# EAGLE design tulip breakout (EAGLE 9.6.2)
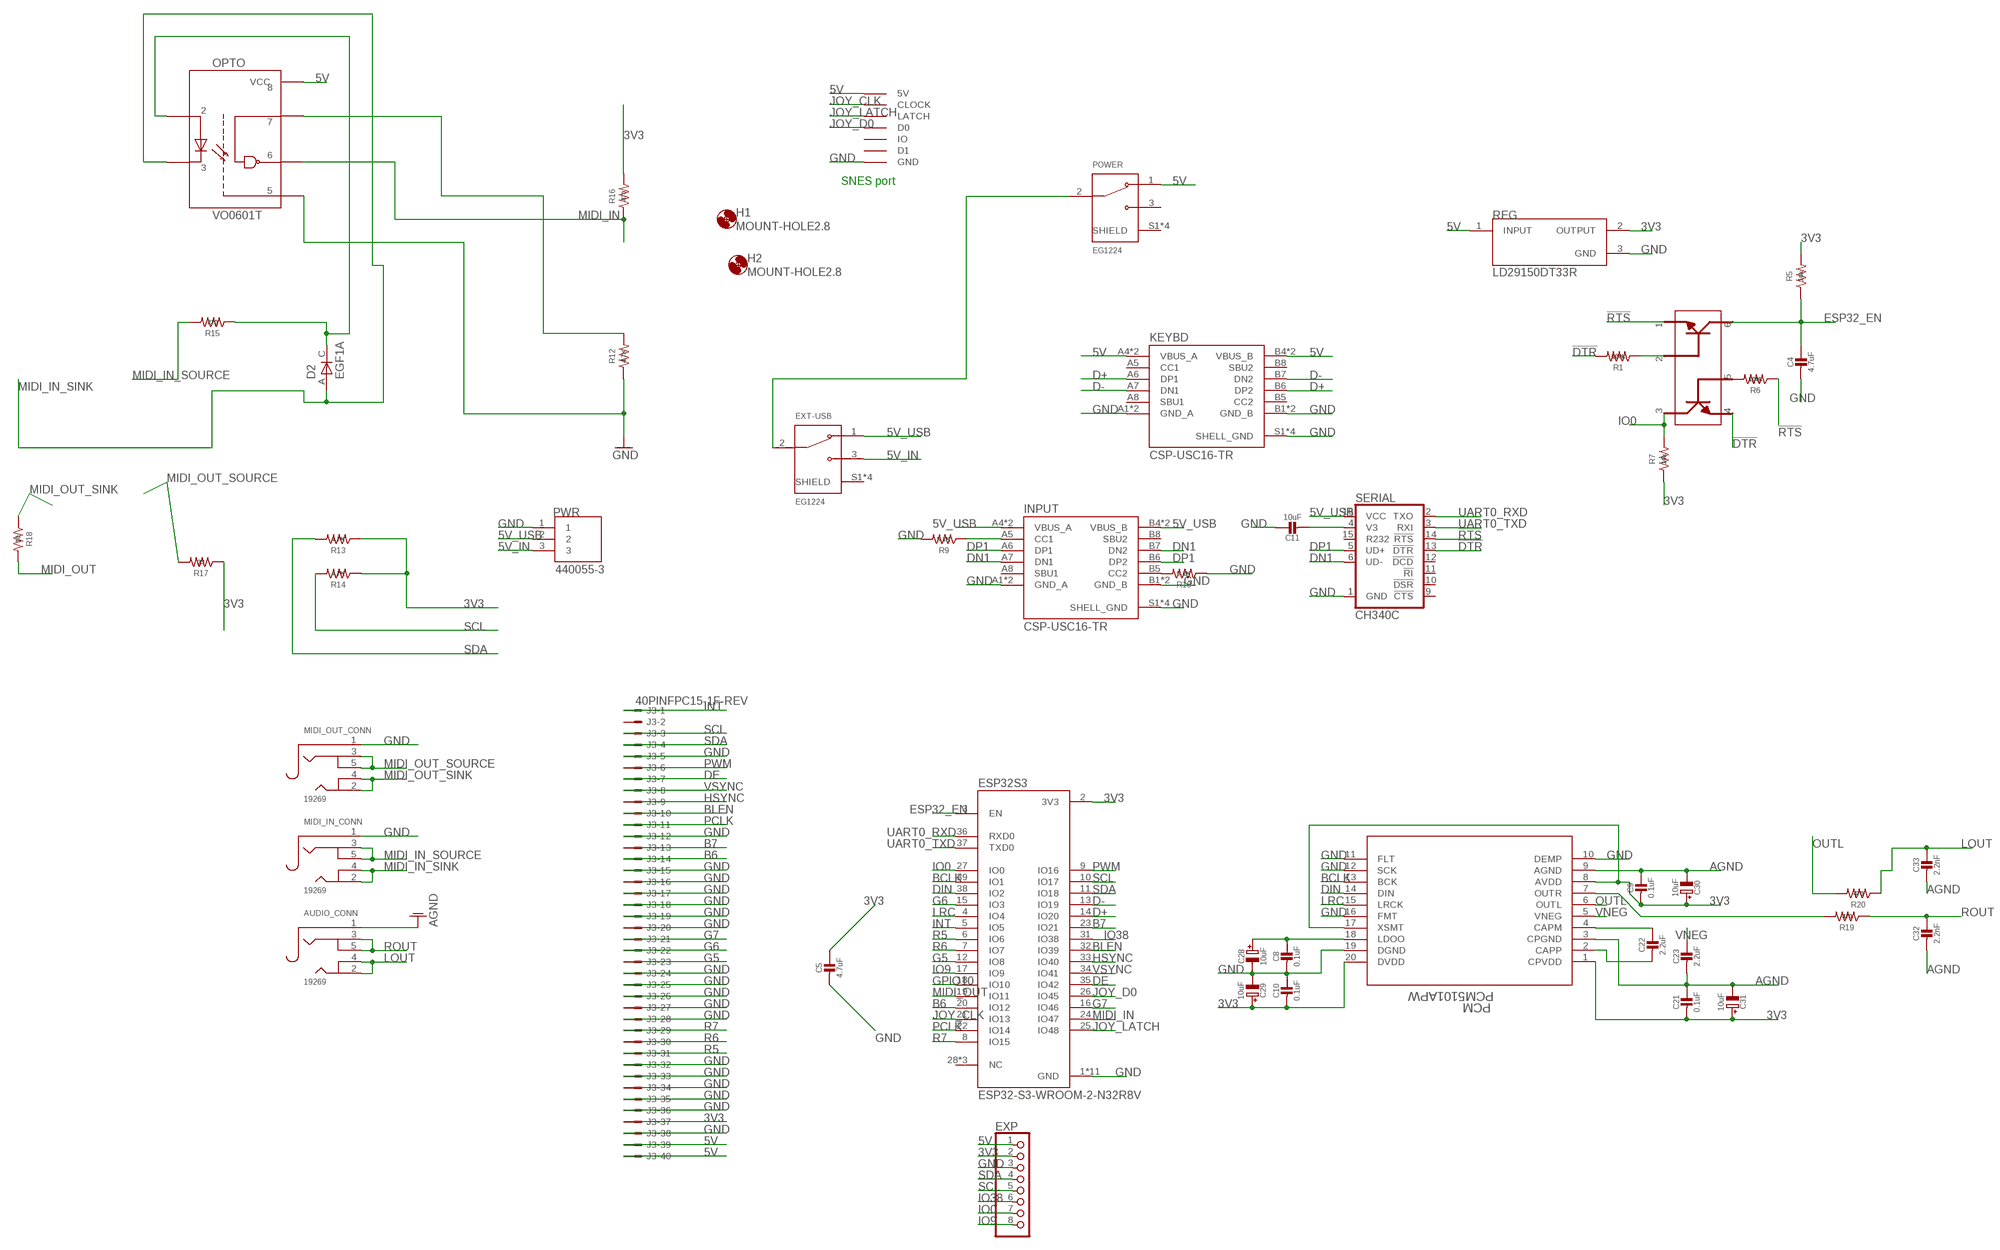
[diagram p0: schematic, sheet 1]

## Parts
AUDIO_CONN  19269  AUDIO_3.5MMJACK  [4UCONN_19269]
C4  4.7uF  CAP_CERAMIC0805-NOOUTLINE  [0805-NO]
C5  4.7uF  CAP_CERAMIC0805-NOOUTLINE  [0805-NO]
C8  0.1uF  CAP_CERAMIC0805-NOOUTLINE  [0805-NO]
C9  0.1uF  CAP_CERAMIC0805-NOOUTLINE  [0805-NO]
C10  0.1uF  CAP_CERAMIC0805-NOOUTLINE  [0805-NO]
C11  10uF  CAP_CERAMIC0805-NOOUTLINE  [0805-NO]
C21  0.1uF  CAP_CERAMIC0805-NOOUTLINE  [0805-NO]
C22  2.2uF  CAP_CERAMIC0805-NOOUTLINE  [0805-NO]
C23  2.2uF  CAP_CERAMIC0805-NOOUTLINE  [0805-NO]
C28  10uF  CAP_ELECTROLYTICPANASONIC_C  [PANASONIC_C]
C29  10uF  CAP_ELECTROLYTICPANASONIC_C  [PANASONIC_C]
C30  10uF  CAP_ELECTROLYTICPANASONIC_C  [PANASONIC_C]
C31  10uF  CAP_ELECTROLYTICPANASONIC_C  [PANASONIC_C]
C32  2.2nF  CAP_CERAMIC0805-NOOUTLINE  [0805-NO]
C33  2.2nF  CAP_CERAMIC0805-NOOUTLINE  [0805-NO]
D2  EGF1A  [DIOM449X264X300L114X135N]
ESP32S3  ESP32-S3-WROOM-2-N32R8V  [XCVR_ESP32-S3-WROOM-2-N32R8V]
EXP  PINHD-1X8BIG  [1X08-BIG]
EXT-USB  EG1224  [SW_EG1224]
H1  MOUNT-HOLE2.8  [2,8]
H2  MOUNT-HOLE2.8  [2,8]
INPUT  CSP-USC16-TR  [VALCON_CSP-USC16-TR]
J3  40PINFPC15-1F-REV  [XF2M-4015-1F-REVERSE]
KEYBD  CSP-USC16-TR  [VALCON_CSP-USC16-TR]
MIDI_IN_CONN  19269  AUDIO_3.5MMJACK  [4UCONN_19269]
MIDI_OUT_CONN  19269  AUDIO_3.5MMJACK  [4UCONN_19269]
OPTO  VO0601T  [SOIC127P610X331-8N]
PCM  PCM5101APW  [PW20_TEX]
POWER  EG1224  [SW_EG1224]
PWR  440055-3  [TE_440055-3]
R1  100k  R-US_R0805  [R0805]
R5  10k  R-US_R0805  [R0805]
R6  100k  R-US_R0805  [R0805]
R7  10k  R-US_R0805  [R0805]
R9  5.1K  R-US_R0805  [R0805]
R10  5.1K  R-US_R0805  [R0805]
R12  4.7K  R-US_R0805  [R0805]
R13  4.7K  R-US_R0805  [R0805]
R14  4.7K  R-US_R0805  [R0805]
R15  220  R-US_R0805  [R0805]
R16  470  R-US_R0805  [R0805]
R17  33  R-US_R0805  [R0805]
R18  10  R-US_R0805  [R0805]
R19  470  R-US_R0805  [R0805]
R20  470  R-US_R0805  [R0805]
REG  LD29150DT33R  [DPAK456P972X240-3N]
RESET  MBT3904DW1T1G  [SOT236]
SERIAL  CH340C  [SO016]
SNES  SNESCONN  [SNESCONN]

## Nets
3V3: C5.1 C9.2 C10.2 C21.2 C29.+ C30.+ C31.+ ESP32S3.2(3V3) EXP.2 J3.37 PCM.1(CPVDD) PCM.8(AVDD) PCM.17(XSMT) PCM.20(DVDD) R5.2 R7.1 R13.1 R14.1 R16.2 R17.1 REG.2(OUTPUT)
5V: EXP.1 J3.39 J3.40 KEYBD.A4(VBUS_A) KEYBD.A9(VBUS_A) KEYBD.B4(VBUS_B) KEYBD.B9(VBUS_B) OPTO.8(VCC) POWER.1 REG.1(INPUT) SNES.5V
5V_IN: EXT-USB.3 PWR.3
5V_USB: EXT-USB.1 INPUT.A4(VBUS_A) INPUT.A9(VBUS_A) INPUT.B4(VBUS_B) INPUT.B9(VBUS_B) PWR.2 SERIAL.16(VCC)
!DTR: R1.2 RESET.4 SERIAL.13(!DTR)
!RTS: R6.1 RESET.1 SERIAL.14(!RTS)
AGND: AUDIO_CONN.1 C9.1 C21.1 C23.2 C30.- C31.- C32.2 C33.2 PCM.3(CPGND) PCM.9(AGND)
B6: ESP32S3.20(IO12) J3.14
B7: ESP32S3.23(IO21) J3.13
BCLK: ESP32S3.39(IO1) PCM.13(BCK)
BLEN: ESP32S3.32(IO39) J3.10
D+: ESP32S3.14(IO20) KEYBD.A6(DP1) KEYBD.B6(DP2)
D-: ESP32S3.13(IO19) KEYBD.A7(DN1) KEYBD.B7(DN2)
DE: ESP32S3.35(IO42) J3.7
DIN: ESP32S3.38(IO2) PCM.14(DIN)
DN1: INPUT.A7(DN1) INPUT.B7(DN2) SERIAL.6(UD-)
DP1: INPUT.A6(DP1) INPUT.B6(DP2) SERIAL.5(UD+)
ESP32_EN: C4.1 ESP32S3.3(EN) R5.1 RESET.6
EXT-USB: EXT-USB.2 POWER.2
G5: ESP32S3.12(IO8) J3.23
G6: ESP32S3.15(IO3) J3.22
G7: ESP32S3.16(IO46) J3.21
GND: C4.2 C5.2 C8.2 C10.1 C11.1 C28.- C29.- ESP32S3.1(GND) ESP32S3.40(GND) ESP32S3.41_1(GND) ESP32S3.41_2(GND) ESP32S3.41_3(GND) ESP32S3.41_4(GND) ESP32S3.41_5(GND) ESP32S3.41_6(GND) ESP32S3.41_7(GND) ESP32S3.41_8(GND) ESP32S3.41_9(GND) EXP.3 INPUT.A1(GND_A) INPUT.A12(GND_A) INPUT.B1(GND_B) INPUT.B12(GND_B) INPUT.S1(SHELL_GND) INPUT.S2(SHELL_GND) INPUT.S3(SHELL_GND) INPUT.S4(SHELL_GND) J3.5 J3.12 J3.15 J3.16 J3.17 J3.18 J3.19 J3.20 J3.24 J3.25 J3.26 J3.27 J3.28 J3.32 J3.33 J3.34 J3.35 J3.36 J3.38 KEYBD.A1(GND_A) KEYBD.A12(GND_A) KEYBD.B1(GND_B) KEYBD.B12(GND_B) KEYBD.S1(SHELL_GND) KEYBD.S2(SHELL_GND) KEYBD.S3(SHELL_GND) KEYBD.S4(SHELL_GND) MIDI_IN_CONN.1 MIDI_OUT_CONN.1 OPTO.5(GND) PCM.10(DEMP) PCM.11(FLT) PCM.12(SCK) PCM.16(FMT) PCM.19(DGND) PWR.1 R9.2 R10.1 R12.1 REG.3(GND) SERIAL.1(GND) SNES.GND
GPIO10: ESP32S3.18(IO10)
HSYNC: ESP32S3.33(IO40) J3.9
INT: ESP32S3.5(IO5) J3.1
IO0: ESP32S3.27(IO0) EXP.7 R7.2 RESET.3
IO9: ESP32S3.17(IO9) EXP.8
IO38: ESP32S3.31(IO38) EXP.6
JOY_CLK: ESP32S3.21(IO13) SNES.CLOCK
JOY_D0: ESP32S3.26(IO45) SNES.D0
JOY_LATCH: ESP32S3.25(IO48) SNES.LATCH
LOUT: AUDIO_CONN.2 AUDIO_CONN.4 C33.1 R20.1
LRC: ESP32S3.4(IO4) PCM.15(LRCK)
MIDI_IN: ESP32S3.24(IO47) OPTO.6(VO) R16.1
MIDI_IN_SINK: D2.A MIDI_IN_CONN.2 MIDI_IN_CONN.4 OPTO.3(C)
MIDI_IN_SOURCE: MIDI_IN_CONN.3 MIDI_IN_CONN.5 R15.2
MIDI_OUT: ESP32S3.19(IO11) R18.2
MIDI_OUT_SINK: MIDI_OUT_CONN.2 MIDI_OUT_CONN.4 R18.1
MIDI_OUT_SOURCE: MIDI_OUT_CONN.3 MIDI_OUT_CONN.5 R17.2
N$1: R1.1 RESET.2
N$2: R6.2 RESET.5
N$3: INPUT.B5(CC2) R10.2
N$7: C8.1 C28.+ PCM.18(LDOO)
N$8: PCM.7(OUTR) R19.2
N$16: C22.1 PCM.4(CAPM)
N$18: C22.2 PCM.2(CAPP)
N$30: D2.C OPTO.2(A) R15.1
N$32: OPTO.7(VE) R12.2
N$38: C11.2 SERIAL.4(V3)
N$42: INPUT.A5(CC1) R9.1
OUTL: PCM.6(OUTL) R20.2
PCLK: ESP32S3.22(IO14) J3.11
PWM: ESP32S3.9(IO16) J3.6
R5: ESP32S3.6(IO6) J3.31
R6: ESP32S3.7(IO7) J3.30
R7: ESP32S3.8(IO15) J3.29
ROUT: AUDIO_CONN.3 AUDIO_CONN.5 C32.1 R19.1
SCL: ESP32S3.10(IO17) EXP.5 J3.3 R14.2
SDA: ESP32S3.11(IO18) EXP.4 J3.4 R13.2
UART0_RXD: ESP32S3.36(RXD0) SERIAL.2(TXO)
UART0_TXD: ESP32S3.37(TXD0) SERIAL.3(RXI)
VNEG: C23.1 PCM.5(VNEG)
VSYNC: ESP32S3.34(IO41) J3.8
Unconnected: ESP32S3.28(NC) ESP32S3.29(NC) ESP32S3.30(NC) EXT-USB.S1(SHIELD) EXT-USB.S2(SHIELD) EXT-USB.S3(SHIELD) EXT-USB.S4(SHIELD) INPUT.A8(SBU1) INPUT.B8(SBU2) J3.2 KEYBD.A5(CC1) KEYBD.A8(SBU1) KEYBD.B5(CC2) KEYBD.B8(SBU2) POWER.3 POWER.S1(SHIELD) POWER.S2(SHIELD) POWER.S3(SHIELD) POWER.S4(SHIELD) SERIAL.9(!CTS) SERIAL.10(!DSR) SERIAL.11(!RI) SERIAL.12(!DCD) SERIAL.15(R232) SNES.D1 SNES.IO

## Notes on the sheet
- SNES port

## Library data of the parts
AUDIO_CONN MIDI_IN_CONN MIDI_OUT_CONN = microbuilder:AUDIO_3.5MMJACK: 3.5MM Audio Jack These are normally connected as follows, from left-to right on the schematic symbol above: Tip: Left Audio Inner Ring: Right Audio Shell: Common/GND
C4 C5 C8-C11 C21-C23 C32 C33 = microbuilder:CAP_CERAMIC: Ceramic Capacitors For new designs, use the packages preceded by an '_' character since they are more reliable: The following footprints should be used on most boards: _0402 - Standard footprint for regular board layouts _0603 - Standard footprint for regular board layouts _0805 - Standard footprint for regular board layouts _1206 - Standard footprint for regular board layouts For extremely tight-pitch boards where space is at a premium, the following 'micro-pitch' footprints can be used (smaller pads, no silkscreen outline, etc.): _0402MP - Micro-pitch footprint for very dense/compact boards _0603MP - Micro-pitch footprint for very dense/compact boards _0805MP - Micro-pitch footprint for very dense/compact boards _1206MP - Micro-pitch footprint for very dense/compact boards
C28-C31 = microbuilder:CAP_ELECTROLYTIC: Electrolytic Capacitors SMT PANASONIC_C - Size C Panasonic Electrolytic Aluminum Capacitor 47µF 16V 20% Electrolytic Capacitor [Digikey: PCE3890TR-ND] PANASONIC_D - Size D Panasonic Electrolytic Aluminum Capacitor 100µF 25V 20% Electrolytic Capacitor [Digikey: PCE3898TR-ND] PTH 3.5 mm grid, 8 mm diameter ... 3.5 mm grid, 10 mm diameter ...
D2 = EGF1A:EGF1A: EGF1A Series 1 A 100 V 50 ns Surface Mount Fast Recovery Rectifier - DO-214AC Check availability <https://pricing.snapeda.com/parts/EGF1A/ON%20Semiconductor/view-part?ref=eda>; AVAILABILITY: In Stock; DESCRIPTION: Diode Standard 50 V 1A Surface Mount DO-214AC (SMA); MF: ON Semiconductor; MP: EGF1A; PACKAGE: SMA-2 ON Semiconductor; PRICE: None; PURCHASE-URL: https://pricing.snapeda.com/search/part/EGF1A/?ref=eda
ESP32S3 = ESP32-S3-WROOM-2-N32R8V:ESP32-S3-WROOM-2-N32R8V: Check availability <https://pricing.snapeda.com/parts/ESP32-S3-WROOM-2-N32R8V/Espressif%20Systems/view-part?ref=eda>; AVAILABILITY: In Stock; DESCRIPTION: Bluetooth, WiFi 802.11b/g/n, Bluetooth v5.0 Transceiver Module 2.4GHz PCB Trace Surface Mount; MF: Espressif Systems; MP: ESP32-S3-WROOM-2-N32R8V; PACKAGE: Package; PRICE: None; PURCHASE-URL: https://pricing.snapeda.com/search/part/ESP32-S3-WROOM-2-N32R8V/?ref=eda
EXP = adafruit:PINHD-1X8: PIN HEADER
EXT-USB POWER = EG1224:EG1224; DESCRIPTION: Slide Switch SPDT Through Hole, Right Angle; DIGI-KEY_PART_NUMBER: EG2585-ND; MF: E-Switch; MP: EG1224; PACKAGE: None; PURCHASE-URL: https://pricing.snapeda.com/search/part/EG1224/?ref=eda
H1 H2 = holes:MOUNT-HOLE: MOUNTING HOLE with drill center marker
INPUT KEYBD = CSP-USC16-TR:CSP-USC16-TR: CSP-USC16-TR Valcon USB Type C Surface Mount PCB Socket Check availability <https://pricing.snapeda.com/parts/CSP-USC16-TR/Valcon/view-part?ref=eda>; AVAILABILITY: In Stock; DESCRIPTION: CSP-USC16-TR Valcon USB Type C Surface Mount PCB Socket; MF: Valcon; MP: CSP-USC16-TR; PACKAGE: None; PRICE: None; PURCHASE-URL: https://pricing.snapeda.com/search/part/CSP-USC16-TR/?ref=eda
J3 = adafruit:40PINFPC: OMRON FPC Connector Source : http://www.omron.com/ecb/products/pdf/fpc.pdf XF2M-4015-rev is good for connecting up 'PSP' SHARP LQ043 LCDs
OPTO = VO0601T:VO0601T: High Speed Optocoupler, 10 MBd, SOIC-8 Package; DESCRIPTION: Logic Output Optoisolator 10MBd Open Drain 4000Vrms 1 Channel 5kV/µs CMTI 8-SOIC; DIGI-KEY_PART_NUMBER: 751-1377-2-ND; MF: Vishay Semiconductors; MP: VO0601T; PACKAGE: None; PURCHASE-URL: https://pricing.snapeda.com/search/part/VO0601T/?ref=eda
PCM = pcm5101apw:PCM5101APW; COPYRIGHT: Copyright (C) 2022 Ultra Librarian. All rights reserved.; DIGI-KEY_PART_NUMBER_1: PCM5101APW-ND; MANUFACTURER_PART_NUMBER: PCM5101APW; MFR_NAME: Texas Instruments
PWR = 440055-3:440055-3; COMMENT: 440055-3; DESCRIPTION: Connector Header Through Hole, Right Angle 3 position 0.079 (2.00mm); DIGI-KEY_PART_NUMBER: A100044-ND; EU_ROHS_COMPLIANCE: Compliant; MF: TE Connectivity; MP: 440055-3; PACKAGE: None; PURCHASE-URL: https://pricing.snapeda.com/search/part/440055-3/?ref=eda
R1 R5-R7 R9 R10 R12-R20 = adafruit:R-US_: RESISTOR, American symbol
REG = LD29150DT33R:LD29150DT33R: LD29150 Series 1.5 A 3.3 V Fixed Output SMT LDO Voltage Regulator - TO-252; DESCRIPTION: Linear Voltage Regulator IC Positive Fixed 1 Output 1.5A DPAK; DIGI-KEY_PART_NUMBER: 497-1496-2-ND; MF: STMicroelectronics; MP: LD29150DT33R; PACKAGE: TO-252 STMicroelectronics; PURCHASE-URL: https://pricing.snapeda.com/search/part/LD29150DT33R/?ref=eda
RESET = MBT3904DW1T1G:MBT3904DW1T1G: Check availability <https://pricing.snapeda.com/parts/MBT3904DW1T1G/ON%20Semiconductor/view-part?ref=eda>; AVAILABILITY: In Stock; DESCRIPTION: Bipolar (BJT) Transistor Array 2 NPN (Dual) 40V 200mA 300MHz 150mW Surface Mount SC-88/SC70-6/SOT-363; MF: ON Semiconductor; MP: MBT3904DW1T1G; PACKAGE: SC-88-6 ON Semiconductor; PRICE: None; PURCHASE-URL: https://pricing.snapeda.com/search/part/MBT3904DW1T1G/?ref=eda
SERIAL = SparkFun-IC-Comms:CH340C; PROD_ID: IC-14038
SNES = gamepad-conn:SNESCONN

## Net classes
1 power: width 0.178 mm

## Board
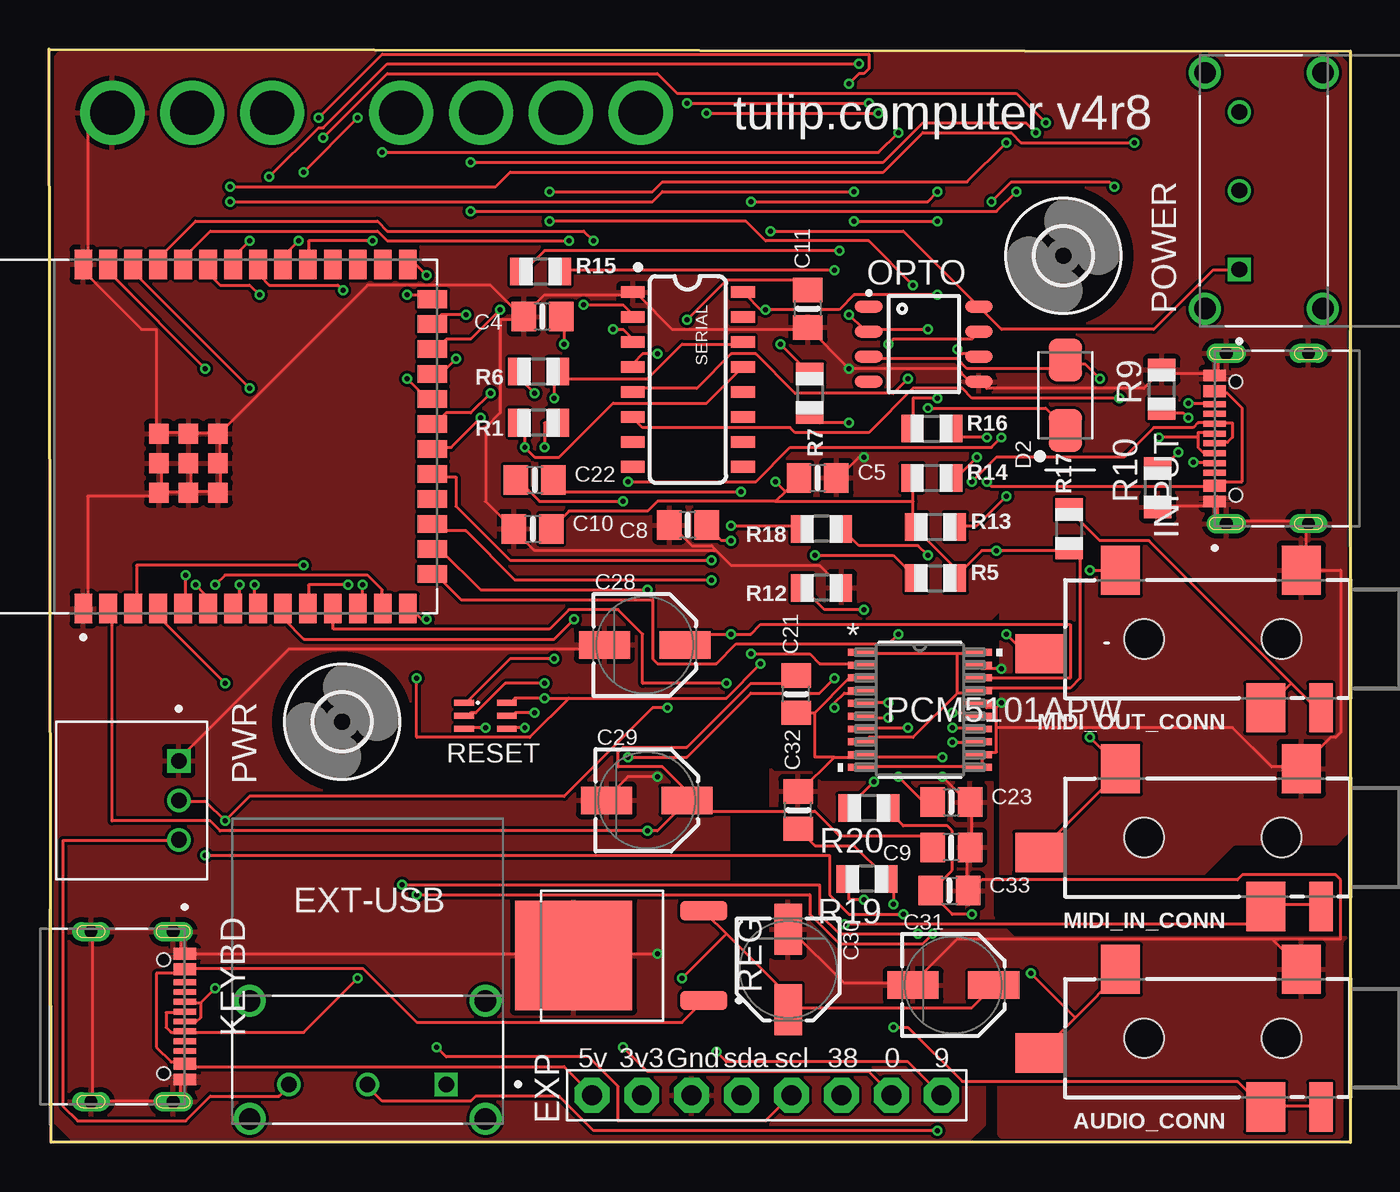
[diagram p1: board, top side]
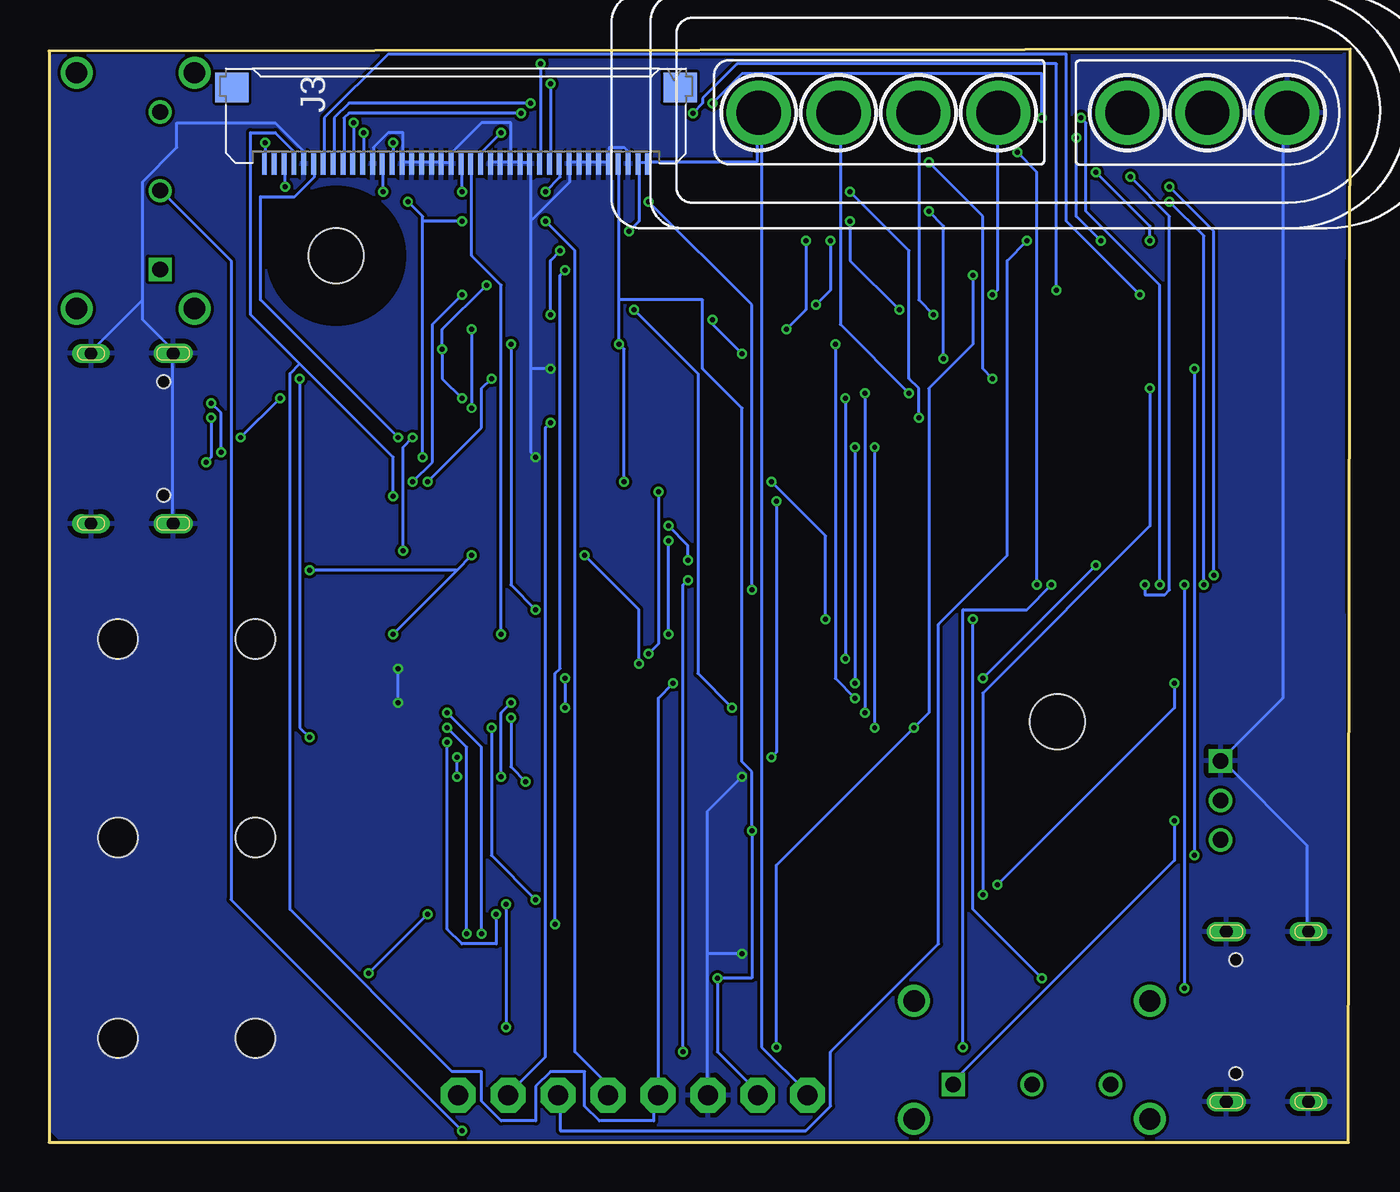
[diagram p2: board, bottom side, seen from below]

Size 66.2 x 55.6 mm. Coordinates in mm from the lower left corner, seen from the top.
Outline: 0.1,0 0,55.6 66.2,55.5 66.2,0 0.1,0
Copper layers (1*16): Top 0.035559375mm / dielectric 1.6mm / Bottom 0.035559375mm
Design rules "oshpark-2layer *": minimum track width 6mil, minimum drill 10mil, track to track 6mil, track to pad 6mil, pad to pad 6mil, via to via 6mil, smd to smd 6mil, copper to edge 0mil, drill to drill 6mil, minimum pad ring 5mil, minimum via ring 5mil, stop-mask expansion 2.5mil, vias tented up to drill 0mil, thermal gap 10mil

### Footprints (pad centres in the part's own frame; a part is rotated, then mirrored left to right if it is on the bottom)
4UCONN_19269 = smd 2 x 2.5: 1 2.5,-3.5; 2 11.7,-3.5; 3 4.3,3.5 | smd 2.5 x 2: 4 15.8,0.75 | smd 1.2 x 2.5: 5 1.5,3.5 | hole 2: 3.5,0; 10.5,0
0805-NO = smd 1.24 x 1.5: 1 -0.95,0; 2 0.95,0
PANASONIC_C = smd 2.6 x 1.4: + 2.05,0; - -2.05,0
DIOM449X264X300L114X135N = smd 2.17 x 1.69: A 1.795,0; C -1.795,0
XCVR_ESP32-S3-WROOM-2-N32R8V = smd 1.5 x 0.9: 1 -8.75,5.26; 2 -8.75,3.99; 3 -8.75,2.72; 4 -8.75,1.45; 5 -8.75,0.18; 6 -8.75,-1.09; 7 -8.75,-2.36; 8 -8.75,-3.63; 9 -8.75,-4.9; 10 -8.75,-6.17; 11 -8.75,-7.44; 12 -8.75,-8.71; 13 -8.75,-9.98; 14 -8.75,-11.25; 27 8.75,-11.25; 28 8.75,-9.98; 29 8.75,-8.71; 30 8.75,-7.44; 31 8.75,-6.17; 32 8.75,-4.9; 33 8.75,-3.63; 34 8.75,-2.36; 35 8.75,-1.09; 36 8.75,0.18; 37 8.75,1.45; 38 8.75,2.72; 39 8.75,3.99; 40 8.75,5.26 | smd 0.9 x 1.5: 15 -6.985,-12.5; 16 -5.715,-12.5; 17 -4.445,-12.5; 18 -3.175,-12.5; 19 -1.905,-12.5; 20 -0.635,-12.5; 21 0.635,-12.5; 22 1.905,-12.5; 23 3.175,-12.5; 24 4.445,-12.5; 25 5.715,-12.5; 26 6.985,-12.5 | smd 1 x 1: 41_1 -1.36,-0.09; 41_2 -2.86,-0.09; 41_3 0.14,-0.09; 41_4 -2.86,-1.59; 41_5 -1.36,-1.59; 41_6 0.14,-1.59; 41_7 -2.86,1.41; 41_8 -1.36,1.41; 41_9 0.14,1.41
1X08-BIG = drill 1.016 pad 1.778 octagon: 1 -8.89,0; 2 -6.35,0; 3 -3.81,0; 4 -1.27,0; 5 1.27,0; 6 3.81,0; 7 6.35,0; 8 8.89,0
SW_EG1224 = drill 0.79 square: 1 -4,1.25 | drill 0.79: 2 0,1.25; 3 4,1.25 | drill 1.09: S1 -6,-3; S2 6,-3; S3 6,3; S4 -6,3
2,8 = hole 2.8: 0,0
VALCON_CSP-USC16-TR = smd 0.3 x 1.14: A1 -3.35,0; A4 -2.55,0; A5 -1.25,0; A6 -0.25,0; A7 0.25,0; A8 1.25,0; A9 2.55,0; A12 3.35,0; B1 3.05,0; B4 2.25,0; B5 1.75,0; B6 0.75,0; B7 -0.75,0; B8 -1.75,0; B9 -2.25,0; B12 -3.05,0 | drill 0.65 pad 1 long: S1 -4.325,-0.59; S2 4.325,-0.59 | drill 0.65 pad 0.9 long: S3 -4.325,-4.77; S4 4.325,-4.77 | hole 0.65: -2.89,-1.07; 2.89,-1.07
XF2M-4015-1F-REVERSE = smd 1.1 x 0.25: 1 -2.54,9.75; 2 -2.54,9.25; 3 -2.54,8.75; 4 -2.54,8.25; 5 -2.54,7.75; 6 -2.54,7.25; 7 -2.54,6.75; 8 -2.54,6.25; 9 -2.54,5.75; 10 -2.54,5.25; 11 -2.54,4.75; 12 -2.54,4.25; 13 -2.54,3.75; 14 -2.54,3.25; 15 -2.54,2.75; 16 -2.54,2.25; 17 -2.54,1.75; 18 -2.54,1.25; 19 -2.54,0.75; 20 -2.54,0.25; 21 -2.54,-0.25; 22 -2.54,-0.75; 23 -2.54,-1.25; 24 -2.54,-1.75; 25 -2.54,-2.25; 26 -2.54,-2.75; 27 -2.54,-3.25; 28 -2.54,-3.75; 29 -2.54,-4.25; 30 -2.54,-4.75; 31 -2.54,-5.25; 32 -2.54,-5.75; 33 -2.54,-6.25; 34 -2.54,-6.75; 35 -2.54,-7.25; 36 -2.54,-7.75; 37 -2.54,-8.25; 38 -2.54,-8.75; 39 -2.54,-9.25; 40 -2.54,-9.75 | smd 1.5 x 1.7: M1 1.36,11.4; M2 1.36,-11.4
SOIC127P610X331-8N = smd 1.4 x 0.6: 1 -2.8,1.905; 2 -2.8,0.635; 3 -2.8,-0.635; 4 -2.8,-1.905; 5 2.8,-1.905; 6 2.8,-0.635; 7 2.8,0.635; 8 2.8,1.905
PW20_TEX = smd 1.473 x 0.356: 1 -2.921,2.925; 2 -2.921,2.275; 3 -2.921,1.625; 4 -2.921,0.975; 5 -2.921,0.325; 6 -2.921,-0.325; 7 -2.921,-0.975; 8 -2.921,-1.625; 9 -2.921,-2.275; 10 -2.921,-2.925; 11 2.921,-2.925; 12 2.921,-2.275; 13 2.921,-1.625; 14 2.921,-0.975; 15 2.921,-0.325; 16 2.921,0.325; 17 2.921,0.975; 18 2.921,1.625; 19 2.921,2.275; 20 2.921,2.925
TE_440055-3 = drill 0.8 pad 1.15 square: 1 0,0 | drill 0.8 pad 1.15: 2 2.007,0; 3 4.013,0
R0805 = smd 1.1 x 1.4: 1 -1,0; 2 1,0
DPAK456P972X240-3N = smd 2.4 x 0.98: 1 -4.2,2.28; 2 -4.2,-2.28 | smd 5.96 x 5.57: 3 2.42,0
SOT236 = smd 0.3 x 1: 1 -0.66,-1.09; 2 0,-1.09; 3 0.66,-1.09; 4 0.66,1.09; 5 0,1.09; 6 -0.66,1.09
SO016 = smd 0.6 x 1.2: 1 -4.445,-2.8; 2 -3.175,-2.8; 3 -1.905,-2.8; 4 -0.635,-2.8; 5 0.635,-2.8; 6 1.905,-2.8; 7 3.175,-2.8; 8 4.445,-2.8; 9 4.445,2.8; 10 3.175,2.8; 11 1.905,2.8; 12 0.635,2.8; 13 -0.635,2.8; 14 -1.905,2.8; 15 -3.175,2.8; 16 -4.445,2.8
SNESCONN = drill 2.25 pad 3.25: 5V 0,4.064; CLOCK 4.064,4.064; D0 12.192,4.064; D1 18.756,4.064; GND 26.884,4.064; IO 22.82,4.064; LATCH 8.128,4.064

### Placement (x,y rotation side)
AUDIO_CONN  66.2,5.3 180 top
C4  25.1,42 180 top
C5  39.1,33.8 0 top
C8  32.5,31.4 180 top
C9  45.9,15 180 top
C10  24.6,31.2 0 top
C11  38.6,42.4 90 top
C21  38,22.8 90 top
C22  24.7,33.7 0 top
C23  45.9,17.3 0 top
C28  30.3,25.3 0 top
C29  30.4,17.4 0 top
C30  37.6,8.8 270 top
C31  46,8 0 top
C32  38.1,16.9 90 top
C33  45.8,12.8 0 top
D2  51.7,38 90 top
ESP32S3  7,35.9 90 top
EXP  36.5,2.4 0 top
EXT-USB  16.2,4.2 180 top
H1  51.6,45.1 0 top
H2  14.9,21.4 0 top
INPUT  59.3,35.8 90 top
J3  45.5,52.3 90 bottom
KEYBD  6.9,6.4 270 top
MIDI_IN_CONN  66.2,15.5 180 top
MIDI_OUT_CONN  66.2,25.6 180 top
OPTO  44.5,40.6 0 top
PCM  44.3,22 0 top
POWER  61.8,48.4 90 top
PWR  6.6,19.4 270 top
R1  24.9,36.6 180 top
R5  45.1,28.7 0 top
R6  24.9,39.2 180 top
R7  38.7,38.1 270 top
R9  56.6,38.3 90 top
R10  56.4,33.3 90 top
R12  39.3,28.2 180 top
R13  45.1,31.3 0 top
R14  44.9,33.8 0 top
R15  25,44.3 0 top
R16  44.9,36.3 0 top
R17  51.9,31.2 90 top
R18  39.3,31.2 180 top
R19  41.6,13.4 180 top
R20  41.7,17 180 top
REG  29.1,9.5 180 top
RESET  22.2,21.7 270 top
SERIAL  32.5,38.8 270 top
SNES  30.1,48.3 0 bottom

### Tracks (layer width: path | path; a pad name or v marks a point on that pad's centre or on a via)
3V3  (via drill 0.25)
  Top 0.152: 46.2,24.85 47.2,24.85 PCM.20 | 46.2,24.85 41.45,24.85 PCM.1 | 46.2,22.85 43.95,20.6 41.7,20.6 41.45,20.35 PCM.8 | 46.2,22.85 47.2,22.85 PCM.17 47.45,23.1 51.95,23.1 52.45,23.6 52.45,30.1 51.95,30.1 R17.1 51.7,30.1 v48.2,30.1 47.45,30.1 46.45,29.1 | 46.2,22.85 46.2,24.85 | 43.95,32.6 43.95,31.35 R13.1 44.2,31.1 46.2,29.1 46.45,29.1 | 43.95,32.6 43.95,33.6 R14.1 | 46.45,29.1 46.2,28.85 R5.2 46.45,29.1 | v47.7,35.85 46.2,35.85 45.95,36.1 R16.2 | R7.1 v37.2,40.6 | C10.2 26.45,32.1 30.45,32.1 30.95,32.6 36.95,32.6 | C5.1 37.45,33.1 | 37.45,33.1 36.95,32.6 | 37.45,33.1 v36.95,33.6 | 36.95,32.6 43.95,32.6 | 34.45,10.6 37.45,7.6 37.45,6.85 C30.+ 37.7,6.85 46.95,6.85 47.95,7.85 C31.+ | 34.45,10.6 33.45,11.6 REG.2 | 34.45,10.6 v32.2,8.35 | C21.2 37.95,23.6 37.7,23.35 35.7,23.35 32.45,20.1 29.2,20.1 28.95,19.85 28.95,19.1 31.2,19.1 32.45,17.85 C29.+ 32.45,17.35 | 32.45,17.35 32.95,16.85 38.95,16.85 40.2,15.6 44.45,15.6 44.95,15.1 C9.2 | 32.45,17.35 30.95,15.85 v30.45,15.85 8.7,15.85 8.2,16.35 3.2,16.35 3.2,27.1 ESP32S3.2
  Bottom 0.152: v47.7,35.85 48.2,35.35 v48.2,30.1 | 37.2,42.85 v37.2,40.6 36.95,40.35 v36.95,33.6 | 37.2,42.85 37.2,49.6 J3.37 | EXP.2 30.2,2.6 32.2,4.6 v32.2,8.35 30.45,8.35 v30.45,15.85 30.45,18.85 30.95,19.35 30.95,37.35 32.95,39.35 32.95,42.85 37.2,42.85
5V  (via drill 0.25)
  Top 0.152: 6.95,3.85 6.95,4.1 KEYBD.B4 6.7,4.1 6.2,4.1 5.45,4.85 5.45,8.6 6.7,8.6 KEYBD.B9 6.95,8.6 6.95,8.85 | 6.95,8.85 15.95,8.85 18.7,6.1 32.2,6.1 33.2,7.1 REG.1 | 6.95,8.85 KEYBD.A4 | 6.95,3.85 26.2,3.85 27.45,2.6 EXP.1 | 6.95,3.85 KEYBD.A9 | POWER.1 60.45,44.35 59.2,44.35 56.2,41.35 48.45,41.35 47.45,42.35 OPTO.8 47.2,42.6 43.45,46.35 v36.7,46.35
  Bottom 0.152: 35.7,49.85 36.2,49.85 J3.39 36.2,49.6 36.2,46.85 v36.7,46.35 | 35.7,49.85 30.2,49.85 30.2,52.35 SNES.5V 29.95,52.35 29.95,4.85 27.7,2.6 EXP.1 | 35.7,49.85 J3.40
5V_IN
  Top 0.152: EXT-USB.3 12.2,2.85 11.7,2.35 8.2,2.35 6.95,1.1 1.45,1.1 0.7,1.85 0.7,15.35 6.45,15.35 PWR.3
5V_USB  (via drill 0.25)
  Top 0.152: PWR.2 6.7,17.35 7.95,17.35 v8.95,16.35 10.2,17.6 26.2,17.6 30.7,22.1 v31.45,22.1 | 59.45,38.1 59.45,38.35 INPUT.A9 | 59.45,33.6 59.45,33.35 INPUT.A4 59.2,33.35 47.95,33.35 v47.7,33.6 | v45.2,43.1 40.95,43.1 40.2,42.35 v36.45,42.35 36.2,42.35 35.45,43.1 SERIAL.16 | 59.45,38.1 59.95,38.1 60.7,37.35 60.7,33.6 59.45,33.6 | 59.45,38.1 INPUT.B4 | 59.45,33.6 INPUT.B9
  Bottom 0.152: v8.95,16.35 8.95,14.35 20.2,3.1 EXT-USB.1 | v45.2,43.1 46.7,41.6 46.7,34.6 v47.7,33.6 | v31.45,22.1 33.2,23.85 33.2,39.1 v36.45,42.35
!DTR  (via drill 0.25)
  Top 0.152: v24.2,21.1 23.45,21.1 RESET.4 | R1.2 24.2,36.6 v24.2,35.35 24.7,34.85 25.95,34.85 28.7,37.6 33.45,37.6 35.2,39.35 SERIAL.13
  Bottom 0.152: v24.2,35.35 v24.2,21.1
!RTS  (via drill 0.25)
  Top 0.152: v25.7,24.6 23.45,24.6 21.2,22.35 RESET.1 | 25.7,38.85 25.7,39.1 R6.1 25.7,38.85 | 25.7,38.85 v25.7,37.85 | 25.7,38.85 30.45,38.85 32.2,40.6 35.2,40.6 SERIAL.14
  Bottom 0.152: v25.7,37.85 v25.7,24.6
AGND  (via drill 0.25)
  Top 0.152: 38.95,21.85 40.7,23.6 41.2,23.6 PCM.3 | C21.1 38.95,21.85 | 39.95,19.6 41.2,19.6 PCM.9 41.45,19.6 v45.45,19.6 | 39.95,19.6 38.2,17.85 C32.2 | 38.95,21.85 38.95,19.6 39.95,19.6 | 62.2,10.35 63.7,8.85 AUDIO_CONN.1 | 62.2,10.35 46.2,10.35 43.95,8.1 | 43.95,8.1 40.45,8.1 37.7,10.85 C30.- | 43.95,8.1 C31.- | 62.2,10.35 65.7,10.35 65.7,13.35 65.45,13.6 60.7,13.6 60.45,13.35 47.45,13.35 46.95,12.85 C33.2 46.7,12.85 46.7,14.85 C9.1 46.95,15.1 46.95,17.1 C23.2 46.7,17.35 v45.45,18.6
  Bottom 0.152: v45.45,18.6 v45.45,19.6
  pour Top: 66,10.4 49.1,10.4 48,11.5 48,18.3 39.3,18.3 38.8,18.8 36.9,18.8 36.7,19 36.7,5.3 47.5,5.3 48.3,4.5 48.3,0.4 48.4,0.3 65.7,0.3 65.8,0.4 65.8,10.2
B6  (via drill 0.25)
  Top 0.152: v48.7,50.85 46.7,48.85 31.2,48.85 30.7,48.35 v25.45,48.35 | v21.95,36.85 20.45,35.35 19.7,35.35 ESP32S3.20
  Bottom 0.152: v48.7,50.85 48.7,49.85 J3.14 | v25.45,48.35 22.45,45.35 22.45,38.85 21.95,38.35 v21.95,36.85
B7  (via drill 0.25)
  Top 0.152: v49.2,48.35 48.2,47.35 v21.45,47.35 | v20.7,39.85 19.95,39.1 19.7,39.1 ESP32S3.23
  Bottom 0.152: v49.2,48.35 49.2,49.6 J3.13 | v21.45,47.35 20.7,46.6 v20.7,39.85
BCLK  (via drill 0.25)
  Top 0.152: v45.95,20.35 47.2,20.35 PCM.13 | v43.45,11.6 40.7,11.6 39.7,12.6 39.7,14.6 v7.95,14.6 | v7.95,39.35 3.2,44.1 3.2,44.6 ESP32S3.39
  Bottom 0.152: v45.95,20.35 45.95,10.85 45.2,10.1 43.45,10.1 v43.45,11.6 | v7.95,39.35 v7.95,14.6
BLEN  (via drill 0.25)
  Top 0.152: v50.7,51.85 49.2,53.35 31.95,53.35 30.95,54.35 17.2,54.35 v13.95,51.1 | v12.7,45.85 11.7,44.85 ESP32S3.32
  Bottom 0.152: v50.7,51.85 50.7,49.85 J3.10 | v13.95,51.1 13.95,47.1 v12.7,45.85
D+  (via drill 0.25)
  Top 0.152: KEYBD.A6 6.7,6.6 5.95,6.6 5.95,5.85 6.2,5.6 6.7,5.6 KEYBD.B6 6.95,5.6 12.95,5.6 v15.7,8.35 | v19.2,26.6 18.95,26.6 18.45,27.1 ESP32S3.14
  Bottom 0.152: v19.2,26.6 19.2,11.85 v15.7,8.35
D-  (via drill 0.25)
  Top 0.152: 7.7,7.1 7.7,6.35 7.45,6.1 6.95,6.1 KEYBD.A7 | 7.7,7.1 6.95,7.1 KEYBD.B7 | v8.45,7.85 7.7,7.1 | v8.45,28.35 8.95,28.85 16.2,28.85 16.95,28.1 16.95,27.35 ESP32S3.13
  Bottom 0.152: v8.45,28.35 v8.45,7.85
DE  (via drill 0.25)
  Top 0.152: v10.7,43.1 10.2,43.6 8.7,43.6 8.2,44.1 8.2,44.6 ESP32S3.35
  Bottom 0.152: v10.7,43.1 14.45,46.85 14.45,55.35 48.95,55.35 52.2,52.1 52.2,49.85 J3.7
DIN  (via drill 0.25)
  Top 0.152: v45.95,21.1 47.2,21.1 PCM.14 | v44.95,10.6 44.45,10.1 40.2,10.1 38.7,11.6 38.7,12.6 v18.7,12.6 | v10.2,38.35 4.45,44.1 4.45,44.6 ESP32S3.38
  Bottom 0.152: v45.95,21.1 44.95,20.1 v44.95,10.6 | v18.7,12.6 18.7,22.85 10.2,31.35 v10.2,38.35
DN1  (via drill 0.25)
  Top 0.152: 58.45,35.85 58.45,36.1 59.2,36.1 INPUT.A7 | 58.45,35.85 58.45,35.35 58.7,35.1 59.2,35.1 INPUT.B7 | v54.45,37.85 46.95,37.85 46.45,38.35 43.95,38.35 41.7,36.1 37.95,36.1 37.7,36.35 30.2,36.35 29.7,36.85 SERIAL.6 | 58.45,35.85 v56.45,35.85
  Bottom 0.152: v56.45,35.85 v54.45,37.85
DP1  (via drill 0.25)
  Top 0.152: INPUT.A6 59.45,35.6 59.95,35.6 60.2,35.85 60.2,36.6 59.45,36.6 INPUT.B6 59.2,36.6 58.45,36.6 58.2,36.35 56.2,36.35 54.7,34.85 48.2,34.85 v46.95,33.6 | v43.7,38.85 42.95,38.1 37.95,38.1 35.95,40.1 34.7,40.1 32.95,38.35 29.7,38.35 SERIAL.5
  Bottom 0.152: v43.7,38.85 44.2,38.35 44.2,36.35 v46.95,33.6
ESP32_EN  (via drill 0.25)
  Top 0.152: v26.2,40.6 26.2,41.85 C4.1 | RESET.6 23.45,22.35 23.7,22.6 v25.2,22.6 26.45,22.6 | R5.1 42.95,29.85 v38.95,29.85 | v36.2,24.35 34.45,22.6 26.45,22.6 | v12.95,29.35 4.45,29.35 4.45,27.35 ESP32S3.3 | v18.7,23.6 18.7,20.6 24.45,20.6 26.45,22.6
  Bottom 0.152: v25.2,22.6 26.2,23.6 v26.2,40.6 | v38.95,29.85 36.2,27.1 v36.2,24.35 | v18.7,23.6 v12.95,29.35
EXT-USB  (via drill 0.25)
  Top 0.152: v45.2,0.6 27.7,0.6 25.95,2.35 21.7,2.35 21.45,2.1 16.95,2.1 16.2,2.85 EXT-USB.2
  Bottom 0.152: v45.2,0.6 56.95,12.35 56.95,44.85 60.45,48.35 POWER.2
G5  (via drill 0.25)
  Top 0.152: v43.2,51.35 42.2,50.35 v16.95,50.35 | v15.95,28.35 15.95,27.35 ESP32S3.12
  Bottom 0.152: v43.2,51.35 44.2,50.35 44.2,49.85 J3.23 | v16.95,50.35 15.95,49.35 v15.95,28.35
G6  (via drill 0.25)
  Top 0.152: v43.2,25.85 42.7,25.35 34.95,25.35 33.95,24.35 30.95,24.35 30.7,24.6 30.7,27.6 20.95,27.6 19.7,28.85 ESP32S3.15
  Bottom 0.152: v43.2,25.85 43.2,43.6 44.7,45.1 44.7,49.6 J3.22
G7  (via drill 0.25)
  Top 0.152: v45.2,48.35 44.7,47.85 v35.7,47.85 | v30.45,28.1 21.95,28.1 19.95,30.1 19.7,30.1 ESP32S3.16
  Bottom 0.152: v45.2,48.35 45.2,49.6 J3.21 | v35.7,47.85 30.45,42.6 v30.45,28.1
GND  (via drill 0.25)
  Top 0.152: v30.95,18.6 29.45,18.6 28.45,17.6 C29.- | KEYBD.B1 6.95,3.35 6.95,3.1 KEYBD.A12 6.7,3.1 6.7,2.1 6.45,2.1 KEYBD.S2 6.2,2.1 2.2,2.1 | 6.95,9.6 6.95,9.85 KEYBD.A1 6.7,9.85 6.7,10.6 6.45,10.6 KEYBD.S1 6.2,10.85 2.2,10.85 KEYBD.S3 2.2,10.6 2.2,2.1 | 6.95,9.6 6.95,9.35 KEYBD.B12 | C28.- 28.2,25.1 12.2,25.1 6.7,19.6 PWR.1 | 2.2,2.1 KEYBD.S4 | 6.95,9.6 26.45,9.6 REG.3 26.7,9.6 v30.95,9.6 | ESP32S3.41_6 8.45,36.1 7.2,36.1 ESP32S3.41_3 6.95,36.1 5.7,36.1 ESP32S3.41_9 5.45,36.1 5.45,41.35 4.7,41.35 1.95,44.1 1.95,44.6 ESP32S3.40 1.95,44.85 1.95,52.35 3.2,52.35 SNES.GND | 7.2,33.1 7.2,34.35 ESP32S3.41_1 | 7.2,33.1 8.45,33.1 ESP32S3.41_4 8.7,33.1 8.7,34.35 ESP32S3.41_5 8.7,34.6 8.7,35.85 ESP32S3.41_6 | 7.2,33.1 ESP32S3.41_2 6.95,33.1 5.7,33.1 | 5.7,33.1 5.7,34.35 ESP32S3.41_8 | ESP32S3.1 1.95,27.35 1.95,32.85 5.45,32.85 ESP32S3.41_7 5.7,33.1 | PCM.10 41.45,19.1 47.2,19.1 PCM.11 47.45,19.1 47.45,19.6 PCM.12 47.45,19.85 48.2,19.85 48.2,21.1 | 48.2,22.1 47.7,22.1 47.45,22.35 PCM.16 | 48.2,21.1 48.2,22.1 | v48.45,24.1 47.45,24.1 PCM.19 | 48.2,22.1 v48.45,22.35 | 59.45,32.35 59.45,32.85 INPUT.B12 | 59.45,32.35 59.45,31.6 59.7,31.6 INPUT.S1 59.95,31.6 63.95,31.6 INPUT.S3 63.95,31.35 63.95,29.1 | 59.45,32.35 INPUT.A1 59.2,32.35 56.45,32.35 R10.1 | 63.7,19.1 65.2,20.6 65.45,20.6 65.7,20.85 65.7,29.1 63.95,29.1 | 63.95,29.1 MIDI_OUT_CONN.1 | 48.2,21.1 60.2,21.1 62.2,19.1 63.7,19.1 | 63.7,19.1 MIDI_IN_CONN.1 | v41.45,34.85 41.2,34.85 40.2,33.85 C5.2 | 33.95,30.1 33.7,30.35 32.7,30.35 31.7,31.35 C8.2 | 33.95,30.1 34.7,29.35 39.2,29.35 40.2,28.35 R12.1 | 33.95,30.1 24.7,30.1 23.7,31.1 C10.1 23.45,31.35 22.2,32.6 22.2,36.35 22.95,37.1 22.95,41.85 23.95,41.85 C4.2
  Top 0.152: 29.7,43.1 25.2,43.1 24.2,42.1 C4.2 | 29.7,43.1 29.95,43.1 31.7,41.35 38.45,41.35 C11.1 v40.7,39.35 46.2,39.35 46.7,38.85 47.2,38.85 OPTO.5 47.45,38.6 47.7,38.35 55.7,38.35 56.45,39.1 R9.2 56.7,39.1 59.2,39.1 INPUT.A12 59.45,39.1 | 29.7,43.1 SERIAL.1 | 59.45,39.1 59.45,38.85 INPUT.B1 | 59.45,39.1 59.45,40.1 59.7,40.1 INPUT.S2 | ESP32S3.41_6 8.7,36.1 16.2,43.6 22.45,43.6 23.95,42.1 C4.2
  Bottom 0.152: v30.95,18.6 32.7,16.85 32.7,9.6 | 32.7,9.6 32.7,2.6 EXP.3 | KEYBD.S3 2.2,10.85 2.2,15.1 6.45,19.35 PWR.1 6.45,19.6 3.45,22.6 3.45,52.35 SNES.GND | v30.95,9.6 32.7,9.6 | v48.45,22.35 v48.45,24.1 | 46.2,49.85 45.7,49.85 | 46.2,49.85 46.7,49.85 | 46.2,49.85 J3.19 | 46.7,49.85 47.2,49.85 | 46.7,49.85 J3.18 | 47.2,49.85 47.7,49.85 | 47.2,49.85 J3.17 | 47.7,49.85 48.2,49.85 | 47.7,49.85 J3.16 | 48.2,49.85 48.2,51.35 48.95,51.35 49.7,50.6 49.7,49.85 J3.12 | 48.2,49.85 J3.15 | 37.7,49.85 37.7,50.6 36.95,50.6 36.7,50.35 36.7,49.85 J3.38 | 37.7,49.85 38.2,49.85 | 37.7,49.85 J3.36 | 38.2,49.85 38.7,49.85 | 38.2,49.85 J3.35 | 38.7,49.85 39.2,49.85 | 38.7,49.85 J3.34 | 39.2,49.85 39.7,49.85 J3.32 39.7,49.6 39.7,48.85 41.7,46.85 | 39.2,49.85 J3.33 | 42.2,49.85 41.7,49.85 J3.28 41.7,49.6 41.7,46.85 | 42.2,49.85 42.7,49.85 | 42.2,49.85 J3.27 | 42.7,49.85 43.2,49.85 | 43.2,49.85 43.7,49.85 J3.24 | 43.2,49.85 J3.25 | v41.45,34.85 41.7,35.1 41.7,39.35 | 41.7,46.85 41.7,39.35 | 45.7,49.85 45.7,50.35 44.2,51.85 42.7,51.85 42.7,49.85 | 45.7,49.85 J3.20 | 42.7,49.85 J3.26 | 61.45,42.85 61.45,41.85 59.95,40.35 INPUT.S2 59.95,40.1 59.95,31.6 INPUT.S1 | 61.45,42.85 61.45,48.85 59.7,50.6 59.7,51.85 54.7,51.85 53.2,50.35 53.2,49.85 J3.5 | 61.45,42.85 63.95,40.35 INPUT.S4 | v40.7,39.35 41.7,39.35
  pour Top: 0.3,55.2 0.3,1 1.2,0.1 46.8,0.1 47.6,0.9 47.6,4.7 47.4,4.9 35,4.9 34.6,5.3 34.6,24.3 36.1,25.8 47.1,25.8 48.4,27.1 48.4,12.8 49.4,11.8 56.9,11.8 60.3,15.2 65.5,15.2 66,15.7 66,54.9 65.5,55.4 0.5,55.4
  pour Bottom: 0.3,55.4 0.3,0.2 65.7,0.2 66.1,0.6 66.1,55.2 66,55.3 0.4,55.3
HSYNC  (via drill 0.25)
  Top 0.152: v33.45,52.35 v42.2,52.35 | v14.95,43.35 14.7,43.6 11.2,43.6 10.7,44.1 10.7,44.6 ESP32S3.33
  Bottom 0.152: v42.2,52.35 50.95,52.35 51.2,52.1 51.2,49.85 J3.9 | v33.45,52.35 32.95,52.85 32.95,53.1 31.2,54.85 14.95,54.85 v14.95,43.35
INT  (via drill 0.25)
  Top 0.152: v55.2,50.85 49.45,50.85 48.95,51.35 44.45,51.35 42.45,49.35 23.45,49.35 22.7,48.6 v9.2,48.6 | v6.95,28.85 6.95,27.35 ESP32S3.5
  Bottom 0.152: v55.2,50.85 55.2,49.85 J3.1 | v9.2,48.6 6.95,46.35 v6.95,28.85
IO0  (via drill 0.25)
  Top 0.152: v22.2,21.1 21.2,21.1 RESET.3 | v19.2,44.1 18.7,44.6 18.45,44.6 ESP32S3.27 | R7.2 39.2,36.6 v40.7,36.6 | v29.2,4.85 30.45,3.6 41.7,3.6 42.7,2.6 EXP.7
  Bottom 0.152: v19.2,44.1 19.2,40.6 21.45,38.35 21.45,21.85 v22.2,21.1 29.2,14.1 v29.2,4.85 | v40.7,36.6 40.95,36.35 40.95,4.35 42.7,2.6 EXP.7
IO9  (via drill 0.25)
  Top 0.152: v33.7,28.6 23.7,28.6 21.2,31.1 19.95,31.1 19.7,31.35 ESP32S3.17 | v33.95,4.6 34.45,4.1 43.7,4.1 45.2,2.6 EXP.8
  Bottom 0.152: v33.7,28.6 33.95,28.35 v33.95,4.6
IO38  (via drill 0.25)
  Top 0.152: v16.45,45.85 13.2,45.85 13.2,44.85 ESP32S3.31
  Bottom 0.152: v16.45,45.85 17.45,44.85 17.45,29.85 20.95,26.35 20.95,10.1 26.45,4.6 26.45,1.85 27.7,0.6 40.2,0.6 40.2,2.35 EXP.6
JOY_CLK  (via drill 0.25)
  Top 0.152: v22.45,38.1 21.45,37.1 20.2,37.1 19.7,36.6 ESP32S3.21
  Bottom 0.152: v22.45,38.1 25.95,41.6 25.95,52.35 SNES.CLOCK
JOY_D0  (via drill 0.25)
  Top 0.152: v18.2,43.1 19.45,43.1 ESP32S3.26
  Bottom 0.152: v18.2,43.1 17.95,43.35 17.95,52.35 SNES.D0
JOY_LATCH  (via drill 0.25)
  Top 0.152: v21.2,42.1 19.95,42.1 19.7,41.85 ESP32S3.25
  Bottom 0.152: v21.2,42.1 21.95,42.85 21.95,52.35 SNES.LATCH
LOUT  (via drill 0.25)
  Top 0.152: R20.1 42.7,16.85 43.45,16.1 45.7,16.1 45.95,15.85 45.95,13.85 44.95,12.85 C33.1 44.95,12.6 45.95,11.6 v46.95,11.6 | 52.2,6.35 54.45,8.6 AUDIO_CONN.2 | 52.2,6.35 AUDIO_CONN.4 | 52.2,6.35 v49.95,8.6
  Bottom 0.152: v49.95,8.6 v46.95,11.6
LRC  (via drill 0.25)
  Top 0.152: v45.95,21.85 47.2,21.85 PCM.15 | v44.2,10.6 40.2,10.6 39.2,11.6 39.2,13.1 v17.95,13.1 | v8.95,23.35 5.7,26.6 5.7,27.1 ESP32S3.4
  Bottom 0.152: v45.95,21.85 44.2,20.1 v44.2,10.6 | v17.95,13.1 8.95,22.1 v8.95,23.35
MIDI_IN  (via drill 0.25)
  Top 0.152: v45.2,37.85 43.95,37.85 43.95,36.35 R16.1 | v46.2,40.35 46.45,40.1 47.2,40.1 OPTO.6 | v22.95,42.35 21.45,40.85 20.2,40.85 19.7,40.35 ESP32S3.24 | v25.45,46.85 35.45,46.85 36.45,45.85 41.7,45.85 v43.95,43.6
  Bottom 0.152: v45.2,37.85 46.2,38.85 v46.2,40.35 46.2,41.35 v43.95,43.6 | v22.95,42.35 25.45,44.85 v25.45,46.85
MIDI_IN_SINK  (via drill 0.25)
  Top 0.152: MIDI_IN_CONN.4 50.45,14.85 54.45,18.85 MIDI_IN_CONN.2 54.45,19.1 v52.95,20.6 | 51.7,39.6 51.45,39.35 46.7,39.35 46.2,39.85 41.7,39.85 OPTO.3 | v53.45,38.85 52.7,39.6 51.7,39.6 | 51.7,39.6 D2.A
  Bottom 0.152: v52.95,20.6 53.45,21.1 v53.45,38.85
MIDI_IN_SOURCE  (via drill 0.25)
  Top 0.152: v39.95,44.35 26.2,44.35 R15.2 | v40.45,11.1 60.95,11.1 61.7,11.85 MIDI_IN_CONN.3 61.95,12.1 64.7,12.1 MIDI_IN_CONN.5
  Bottom 0.152: v39.95,44.35 40.2,44.1 40.2,24.1 40.45,23.85 v40.45,11.1
MIDI_OUT  (via drill 0.25)
  Top 0.152: v34.7,31.35 38.2,31.35 R18.2 | v33.7,29.6 23.45,29.6 20.7,32.35 20.7,33.85 19.7,33.85 ESP32S3.19
  Bottom 0.152: v34.7,31.35 33.7,30.35 v33.7,29.6
MIDI_OUT_SINK  (via drill 0.25)
  Top 0.152: v44.7,29.85 44.2,30.35 41.2,30.35 40.45,31.1 R18.1 | v48.7,25.85 49.7,24.85 MIDI_OUT_CONN.4 | v52.95,29.1 MIDI_OUT_CONN.2
  Bottom 0.152: v48.7,25.85 45.45,29.1 | 45.45,29.1 v44.7,29.85 | 45.45,29.1 v52.95,29.1
MIDI_OUT_SOURCE
  Top 0.152: 63.2,23.35 64.45,22.1 MIDI_OUT_CONN.5 | 63.2,23.35 55.95,30.6 53.45,30.6 51.95,32.1 R17.2 | 63.2,23.35 61.95,22.1 MIDI_OUT_CONN.3
N$1  (via drill 0.25)
  Top 0.152: v25.2,23.35 23.2,23.35 21.7,21.85 21.45,21.85 21.2,21.6 RESET.2 | v25.2,35.35 25.2,36.6 R1.1
  Bottom 0.152: v25.2,35.35 v25.2,23.35
N$2  (via drill 0.25)
  Top 0.152: v24.7,21.85 23.7,21.85 23.45,21.6 RESET.5 | v24.7,38.1 23.7,39.1 R6.2
  Bottom 0.152: v24.7,38.1 v24.7,21.85
N$3  (via drill 0.25)
  Top 0.152: v57.95,37.6 59.2,37.6 INPUT.B5 | v57.45,35.1 56.7,34.35 56.45,34.35 R10.2
  Bottom 0.152: v57.95,37.6 57.45,37.1 v57.45,35.1
N$7  (via drill 0.25)
  Top 0.152: PCM.18 47.45,23.6 51.95,23.6 51.95,26.35 36.2,26.35 35.7,25.85 v34.7,25.85 32.95,25.85 32.45,25.35 C28.+ | v34.7,30.6 34.2,30.6 33.45,31.35 C8.1
  Bottom 0.152: v34.7,25.85 v34.7,30.6
N$8  (via drill 0.25)
  Top 0.152: v41.45,12.35 40.7,12.35 40.7,13.35 R19.2 | v43.7,21.1 41.45,21.1 PCM.7
  Bottom 0.152: v41.45,12.35 43.7,14.6 v43.7,21.1
N$16  (via drill 0.25)
  Top 0.152: v39.95,22.1 39.95,22.35 40.45,22.85 41.2,22.85 PCM.4 | v39.95,23.6 39.2,22.85 35.7,22.85 32.45,19.6 v29.45,19.6 | v29.2,32.6 24.95,32.6 23.95,33.6 C22.1
  Bottom 0.152: v39.95,23.6 v39.95,22.1 | v29.45,19.6 29.2,19.85 v29.2,32.6
N$18  (via drill 0.25)
  Top 0.152: v35.7,24.85 38.7,24.85 39.2,24.35 41.2,24.35 PCM.2 | v35.2,33.1 26.2,33.1 25.7,33.6 C22.2
  Bottom 0.152: v35.7,24.85 35.2,25.35 v35.2,33.1
N$30  (via drill 0.25)
  Top 0.152: v40.2,45.35 25.2,45.35 24.2,44.35 R15.1 | v40.7,42.1 41.45,41.35 41.7,41.35 | v44.7,37.35 50.7,37.35 51.7,36.35 D2.C | 41.7,41.35 v44.7,41.35 | 41.7,41.35 OPTO.2
  Bottom 0.152: v40.2,45.35 40.7,44.85 v40.7,42.1 | v44.7,41.35 v44.7,37.35
N$32  (via drill 0.25)
  Top 0.152: v41.45,27.1 39.45,27.1 38.45,28.1 R12.2 | v42.7,40.6 42.95,40.85 46.95,40.85 47.2,41.1 OPTO.7
  Bottom 0.152: v41.45,27.1 42.7,28.35 v42.7,40.6
N$38  (via drill 0.25)
  Top 0.152: v30.95,40.1 30.2,40.1 29.7,39.6 SERIAL.4 | v32.45,41.85 34.45,43.85 37.95,43.85 38.45,43.35 C11.2
  Bottom 0.152: v30.95,40.1 32.45,41.6 v32.45,41.85
N$42  (via drill 0.25)
  Top 0.152: v58.2,34.6 59.2,34.6 INPUT.A5 | v57.95,36.85 57.7,37.1 56.7,37.1 R9.1
  Bottom 0.152: v58.2,34.6 57.95,34.85 v57.95,36.85
OUTL  (via drill 0.25)
  Top 0.152: v41.95,18.35 40.7,17.1 R20.2 | v42.7,21.6 41.45,21.6 PCM.6
  Bottom 0.152: v41.95,18.35 42.7,19.1 v42.7,21.6
PCLK  (via drill 0.25)
  Top 0.152: v50.2,51.35 49.7,51.85 44.45,51.85 42.45,49.85 v21.45,49.85 | v18.2,38.85 19.2,37.85 19.45,37.85 ESP32S3.22
  Bottom 0.152: v50.2,51.35 50.2,49.85 J3.11 | v21.45,49.85 18.7,47.1 18.7,39.35 v18.2,38.85
PWM  (via drill 0.25)
  Top 0.152: v48.45,35.85 47.95,35.35 37.7,35.35 35.95,33.6 v29.45,33.6 | v26.7,26.6 25.7,25.6 12.95,25.6 11.95,26.6 11.95,27.1 ESP32S3.9
  Bottom 0.152: v48.45,35.85 55.45,42.85 55.45,48.1 53.7,48.1 52.7,49.1 52.7,49.6 J3.6 | v29.45,33.6 26.7,30.85 v26.7,26.6
R5  (via drill 0.25)
  Top 0.152: v40.95,48.35 31.2,48.35 30.7,47.85 v9.2,47.85 | v7.45,28.35 7.95,27.85 7.95,27.35 ESP32S3.6
  Bottom 0.152: v40.95,48.35 40.2,49.1 40.2,49.6 J3.31 | v9.2,47.85 7.45,46.1 v7.45,28.35
R6  (via drill 0.25)
  Top 0.152: v40.7,53.85 41.2,54.35 41.45,54.35 41.7,54.6 41.7,55.35 16.95,55.35 v13.7,52.1 | v9.7,28.35 9.7,27.35 9.45,27.35 ESP32S3.7
  Bottom 0.152: v40.7,53.85 40.7,49.85 J3.30 | v13.7,52.1 13.45,51.85 13.45,47.35 9.7,43.6 v9.7,28.35
R7  (via drill 0.25)
  Top 0.152: v41.2,54.85 17.2,54.85 13.95,51.6 13.7,51.6 v11.2,49.1 | v10.45,28.35 10.45,27.35 ESP32S3.8
  Bottom 0.152: v41.2,54.85 41.2,49.85 J3.29 | v11.2,49.1 9.2,47.1 9.2,28.1 9.45,27.85 10.45,27.85 v10.45,28.35
ROUT  (via drill 0.25)
  Top 0.152: AUDIO_CONN.5 64.7,1.85 61.95,1.85 AUDIO_CONN.3 61.7,1.85 60.45,3.1 46.45,3.1 43.7,5.85 v42.95,5.85 | C32.1 38.95,15.1 40.95,15.1 42.45,13.6 R19.1 42.7,13.35 42.95,13.35 v42.95,12.1
  Bottom 0.152: v42.95,12.1 v42.95,5.85
SCL  (via drill 0.25)
  Top 0.152: v54.2,48.6 53.95,48.85 48.95,48.85 v47.95,47.85 | v47.2,34.85 46.2,33.85 45.95,33.85 R14.2 | v15.2,28.35 13.2,28.35 13.2,27.35 ESP32S3.10 | v19.7,4.85 20.2,4.35 27.45,4.35 28.95,2.85 28.95,1.1 36.45,1.1 37.7,2.35 EXP.5 | v40.95,46.85 v45.2,46.85
  Bottom 0.152: v54.2,48.6 54.2,49.6 J3.3 | v47.95,47.85 47.2,47.1 47.2,46.85 | v47.2,34.85 47.2,46.85 | v15.2,28.35 16.45,27.1 19.7,27.1 v19.7,4.85 | v45.2,46.85 47.2,46.85 | v40.95,46.85 39.45,45.35 39.45,4.6 37.95,3.1 37.95,2.6 EXP.5
SDA  (via drill 0.25)
  Top 0.152: v48.7,32.85 47.2,31.35 46.2,31.35 R13.2 | v34.45,23.35 30.2,23.35 30.2,25.85 28.95,27.1 26.45,27.1 25.45,26.1 14.45,26.1 14.45,27.1 ESP32S3.11
  Bottom 0.152: 53.45,39.6 48.7,34.85 v48.7,32.85 | 53.45,39.6 55.95,42.1 55.95,51.35 54.7,51.35 53.7,50.35 53.7,49.85 J3.4 | v34.45,23.35 35.2,22.6 35.2,2.6 EXP.4 35.45,2.35 35.45,1.1 38.2,1.1 38.95,1.85 38.95,3.6 40.7,3.6 41.45,2.85 41.45,1.1 43.2,1.1 44.2,2.1 44.2,3.6 45.7,3.6 53.95,11.85 53.95,39.1 53.45,39.6
UART0_RXD  (via drill 0.25)
  Top 0.152: v27.2,42.6 29.2,42.6 29.7,42.1 SERIAL.2 | v26.45,45.85 17.2,45.85 16.7,46.35 8.2,46.35 6.7,44.85 ESP32S3.36
  Bottom 0.152: v27.2,42.6 26.45,43.35 v26.45,45.85
UART0_TXD  (via drill 0.25)
  Top 0.152: v28.7,41.35 29.2,41.35 29.7,40.85 SERIAL.3 | v27.7,45.85 27.2,46.35 17.2,46.35 16.7,46.85 7.45,46.85 5.45,44.85 ESP32S3.37
  Bottom 0.152: v28.7,41.35 27.7,42.35 v27.7,45.85
VNEG  (via drill 0.25)
  Top 0.152: v42.7,22.35 41.45,22.35 PCM.5 | v43.2,18.6 44.45,17.35 44.95,17.35 C23.1
  Bottom 0.152: v42.7,22.35 43.2,21.85 v43.2,18.6
VSYNC  (via drill 0.25)
  Top 0.152: v32.45,52.85 v41.7,52.85 | v12.95,49.35 v15.7,52.1 | v10.2,45.85 9.2,44.85 ESP32S3.34
  Bottom 0.152: v41.7,52.85 50.95,52.85 51.7,52.1 51.7,49.85 J3.8 | v32.45,52.85 30.95,54.35 15.7,54.35 v15.7,52.1 | v12.95,49.35 10.2,46.6 v10.2,45.85

### Text on the board
tNames: tulip.computer v4r8 | RESET | 5v | 3v3 | Gnd | sda | scl | 38 | 0 | 9
tValues: Close
Measures: All dimensions in inches | Units: Inches